# EAGLE design MMMM Bottom (EAGLE 9.1.0)
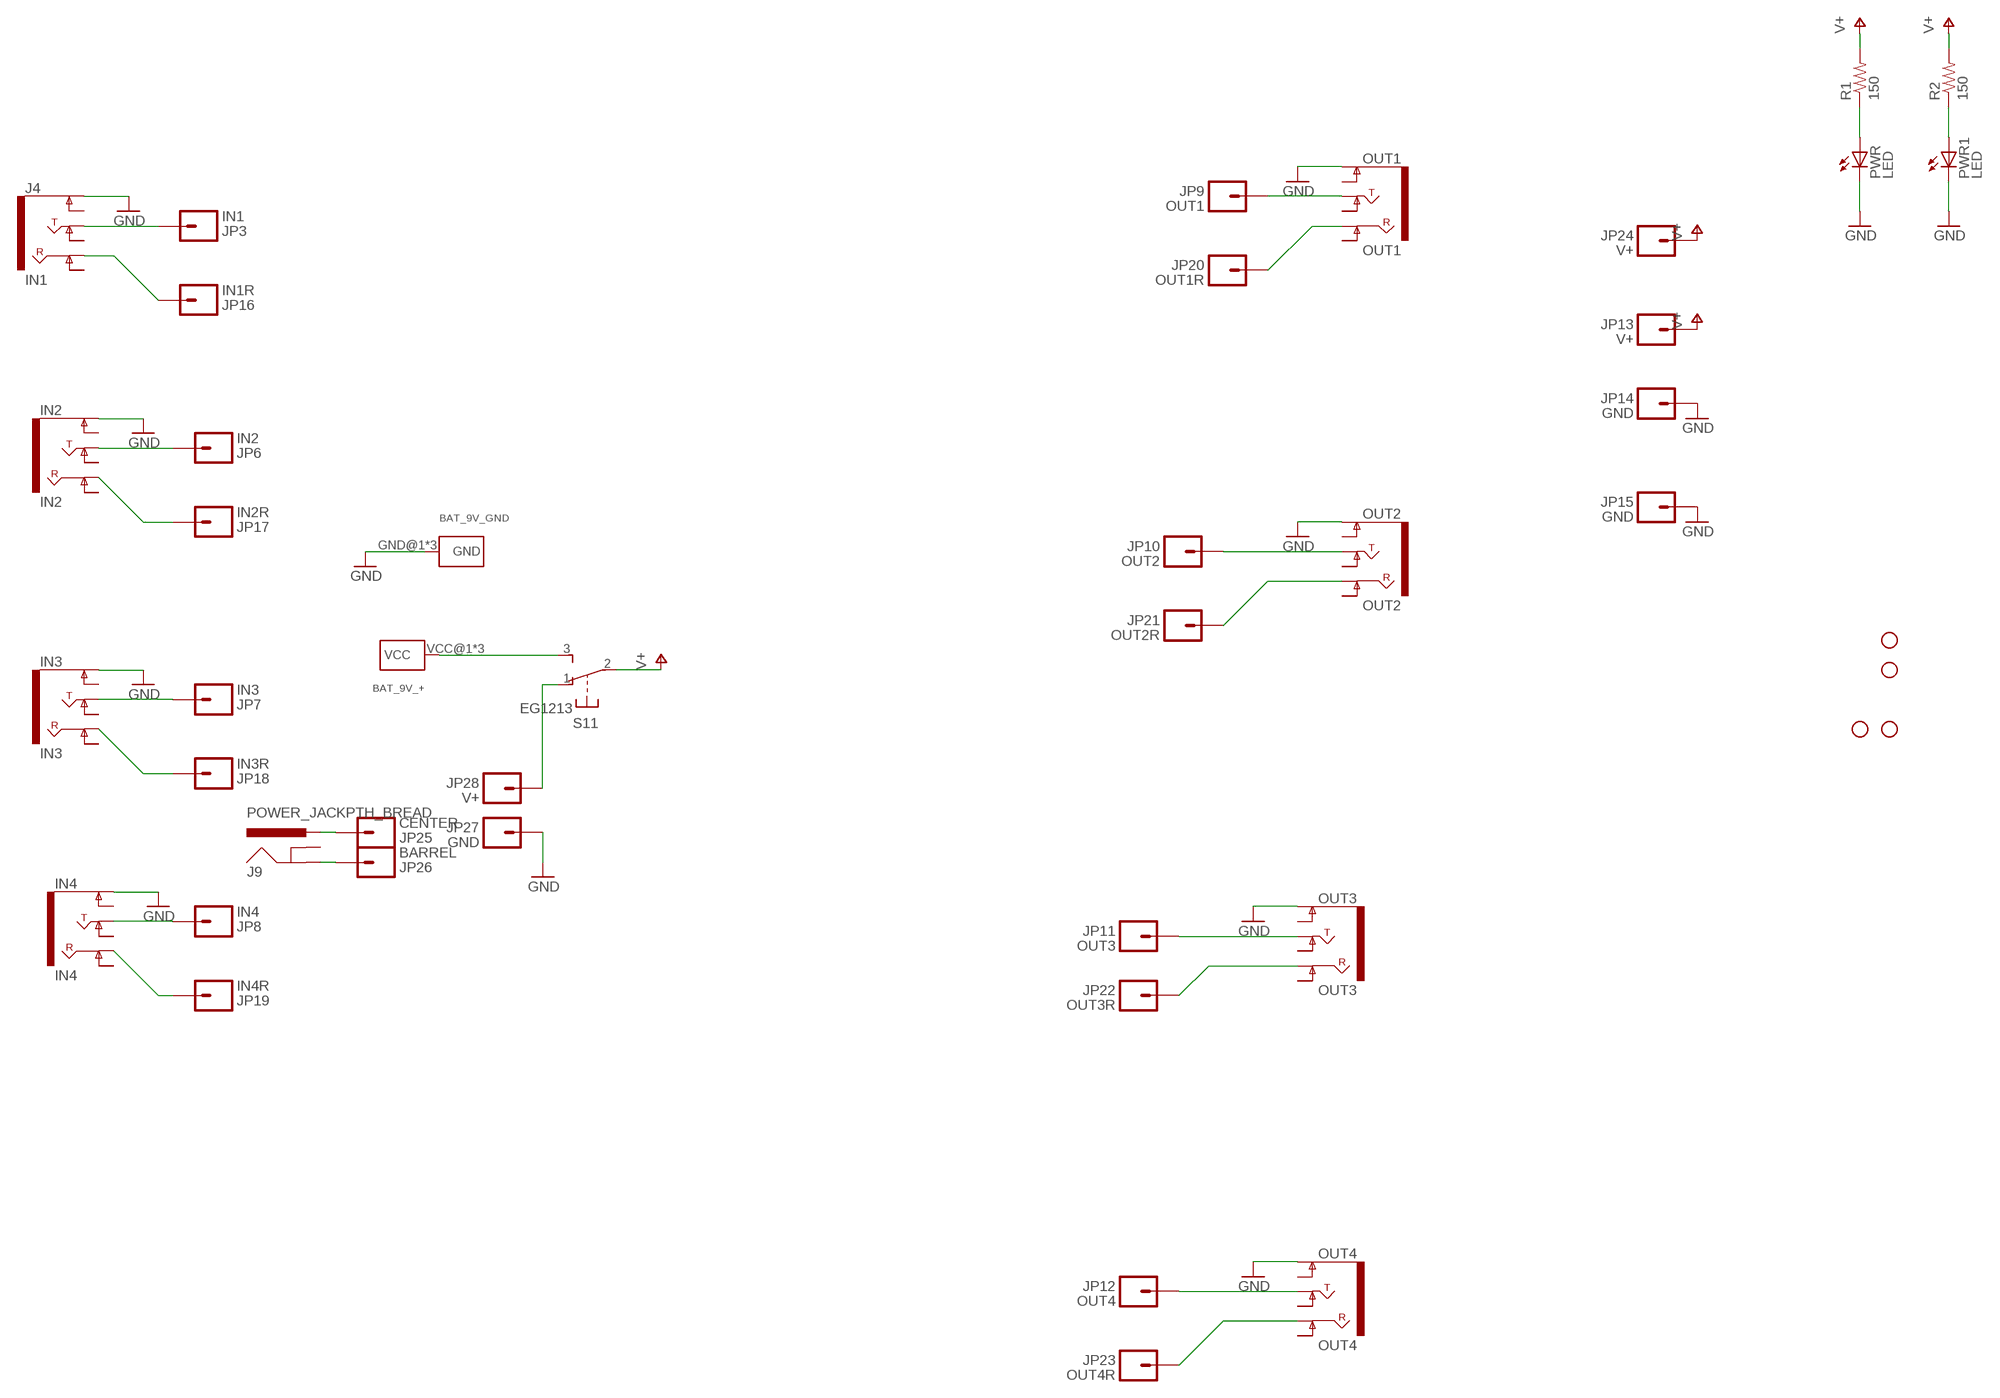
[diagram p0: schematic, sheet 1]

## Parts
BAT_9V_+  KEYSTONE-637  [KEYSTONE_AA_AAA_BATTERY_TERMINAL-637]
BAT_9V_GND  KEYSTONE-629  [KEYSTONE_AA_AAA_BATTERY_TERMINAL-629]
IN2  IN2  AUDIO-JACK4-.25-HORIZ-TRS  [AUDIO-JACK-.25-INCH-HORIZ-PTH]
IN3  IN3  AUDIO-JACK4-.25-HORIZ-TRS  [AUDIO-JACK-.25-INCH-HORIZ-PTH]
IN4  IN4  AUDIO-JACK4-.25-HORIZ-TRS  [AUDIO-JACK-.25-INCH-HORIZ-PTH]
J4  IN1  AUDIO-JACK4-.25-HORIZ-TRS  [AUDIO-JACK-.25-INCH-HORIZ-PTH]
J9  POWER_JACKPTH_BREAD  [POWER_JACK_PTH_BREAD]
JP1  STAND-OFF  [STAND-OFF]
JP2  STAND-OFF  [STAND-OFF]
JP3  IN1  HEADER-1X1  [1X01_SIDE_NAME]
JP4  STAND-OFF  [STAND-OFF]
JP5  STAND-OFF  [STAND-OFF]
JP6  IN2  HEADER-1X1  [1X01_SIDE_NAME]
JP7  IN3  HEADER-1X1  [1X01_SIDE_NAME]
JP8  IN4  HEADER-1X1  [1X01_SIDE_NAME]
JP9  OUT1  HEADER-1X1  [1X01_SIDE_NAME]
JP10  OUT2  HEADER-1X1  [1X01_SIDE_NAME]
JP11  OUT3  HEADER-1X1  [1X01_SIDE_NAME]
JP12  OUT4  HEADER-1X1  [1X01_SIDE_NAME]
JP13  V+  HEADER-1X1  [1X01_SIDE_NAME]
JP14  GND  HEADER-1X1  [1X01_SIDE_NAME]
JP15  GND  HEADER-1X1  [1X01_SIDE_NAME]
JP16  IN1R  HEADER-1X1  [1X01_SIDE_NAME]
JP17  IN2R  HEADER-1X1  [1X01_SIDE_NAME]
JP18  IN3R  HEADER-1X1  [1X01_SIDE_NAME]
JP19  IN4R  HEADER-1X1  [1X01_SIDE_NAME]
JP20  OUT1R  HEADER-1X1  [1X01_SIDE_NAME]
JP21  OUT2R  HEADER-1X1  [1X01_SIDE_NAME]
JP22  OUT3R  HEADER-1X1  [1X01_SIDE_NAME]
JP23  OUT4R  HEADER-1X1  [1X01_SIDE_NAME]
JP24  V+  HEADER-1X1  [1X01_SIDE_NAME]
JP25  CENTER  HEADER-1X11X01_SIDE_NAME_SML  [1X01_SIDE_NAME_SML]
JP26  BARREL  HEADER-1X11X01_SIDE_NAME_SML  [1X01_SIDE_NAME_SML]
JP27  GND  HEADER-1X11X01_SIDE_NAME_SML  [1X01_SIDE_NAME_SML]
JP28  V+  HEADER-1X11X01_SIDE_NAME_SML  [1X01_SIDE_NAME_SML]
OUT1  OUT1  AUDIO-JACK4-.25-HORIZ-TRS  [AUDIO-JACK-.25-INCH-HORIZ-PTH]
OUT2  OUT2  AUDIO-JACK4-.25-HORIZ-TRS  [AUDIO-JACK-.25-INCH-HORIZ-PTH]
OUT3  OUT3  AUDIO-JACK4-.25-HORIZ-TRS  [AUDIO-JACK-.25-INCH-HORIZ-PTH]
OUT4  OUT4  AUDIO-JACK4-.25-HORIZ-TRS  [AUDIO-JACK-.25-INCH-HORIZ-PTH]
PWR  LED  LED-3MM-MINUS  [LED3MM-MINUS]
PWR1  LED  LED-3MM-MINUS  [LED3MM-MINUS]
R1  150  R-US_0204/5  [0204/5]
R2  150  R-US_0204/5  [0204/5]
S1  EG1213  [EG1213]

## Nets
GND: BAT_9V_GND.GND@1(GND) BAT_9V_GND.GND@2(GND) BAT_9V_GND.GND@3(GND) IN2.SLEEVE(EARTH) IN3.SLEEVE(EARTH) IN4.SLEEVE(EARTH) J4.SLEEVE(EARTH) JP14.1 JP15.1 JP27.1 OUT1.SLEEVE(EARTH) OUT2.SLEEVE(EARTH) OUT3.SLEEVE(EARTH) OUT4.SLEEVE(EARTH) PWR1.K(C) PWR.K(C)
N$1: PWR.A R1.1
N$2: IN2.TIP JP6.1
N$3: JP9.1 OUT1.TIP
N$4: IN3.TIP JP7.1
N$5: J4.TIP JP3.1
N$6: IN4.TIP JP8.1
N$7: J4.RING JP16.1
N$8: IN3.RING JP18.1
N$9: IN4.RING JP19.1
N$10: IN2.RING JP17.1
N$11: JP20.1 OUT1.RING
N$12: JP23.1 OUT4.RING
N$13: JP22.1 OUT3.RING
N$14: JP21.1 OUT2.RING
N$15: JP28.1 S1.1(1:O)
N$16: BAT_9V_+.VCC@1(VCC) BAT_9V_+.VCC@2(VCC) BAT_9V_+.VCC@3(VCC) S1.3(1:S)
N$17: PWR1.A R2.1
N$18: J9.PWR JP25.1
N$19: J9.GND JP26.1
N$27: JP10.1 OUT2.TIP
N$35: JP11.1 OUT3.TIP
N$43: JP12.1 OUT4.TIP
V+: JP13.1 JP24.1 R1.2 R2.2 S1.2(1:P)
Unconnected: IN2.RING-NORM IN2.SLEEVE-NORM(EARTH-NORM) IN2.TIP-NORM IN3.RING-NORM IN3.SLEEVE-NORM(EARTH-NORM) IN3.TIP-NORM IN4.RING-NORM IN4.SLEEVE-NORM(EARTH-NORM) IN4.TIP-NORM J4.RING-NORM J4.SLEEVE-NORM(EARTH-NORM) J4.TIP-NORM J9.GNDBREAK OUT1.RING-NORM OUT1.SLEEVE-NORM(EARTH-NORM) OUT1.TIP-NORM OUT2.RING-NORM OUT2.SLEEVE-NORM(EARTH-NORM) OUT2.TIP-NORM OUT3.RING-NORM OUT3.SLEEVE-NORM(EARTH-NORM) OUT3.TIP-NORM OUT4.RING-NORM OUT4.SLEEVE-NORM(EARTH-NORM) OUT4.TIP-NORM S1.MT1(MT) S1.MT2(MT)

## Library data of the parts
BAT_9V_+ = kanflo:KEYSTONE-637: Keystone 637 PCB Mount Battery Contact for 1 (AA), 1 (AAA), 1 (N), Button Contact Links Data sheet <http://docs-europe.electrocomponents.com/webdocs/13ee/0900766b813ee63e.pdf> RS Online <http://se.rs-online.com/web/p/battery-holders-mounts/3670602/>
BAT_9V_GND = kanflo:KEYSTONE-629: Keystone 629 PCB Mount Battery Contact for 1 (AA), 1 (AAA), 1 (N), Coil Spring Contact Links Data sheet <http://docs-europe.electrocomponents.com/webdocs/002e/0900766b8002ef6f.pdf> RS Online <http://se.rs-online.com/web/p/battery-holders-mounts/2050057/>
IN2-IN4 J4 OUT1-OUT4 = SparkFun-Connectors:AUDIO-JACK4-.25-HORIZ-TRS: 1/4" TRS jack, horizontal Production SKU: COM-11144 Footprint unproven - datasheet and part seem to be slightly different; PROD_ID: CONN-12339; SF_ID: COM-11144
J9 = SparkFun-Connectors:POWER_JACK: Power Jack This is the standard 5.5mm barrel jack for power. The PTH is the most common, proven, reliable, footprint. The Slot footprint only works if the mill layer is transmitted to the PCB fab house so be warned. Mating wall wart : TOL-00298 (and others); PROD_ID: PRT-10811
JP1 JP2 JP4 JP5 = SparkFun:STAND-OFF: Stand Off This is the mechanical footprint for a #4 phillips button head screw. Use the keepout ring to avoid running the screw head into surrounding components. SKU : PRT-00447
JP3 JP6-JP28 = TOF:HEADER-1X1: Header 1 Standard 1-pin 0.1" header. Use with straight break away headers (SKU : PRT-00116), right angle break away headers (PRT-00553), swiss pins (PRT-00743), machine pins (PRT-00117), and female headers (PRT-00115).
PWR PWR1 = akafugu:LED: LEDs Standard schematic elements and footprints for 5mm, 3mm, 1206, and 0603 sized LEDs. 5mm - Spark Fun Electronics SKU : COM-00529 (and others)
R1 R2 = adafruit:R-US_: RESISTOR, American symbol
S1 = adafruit:EG1213: E-Switch right-angle slide SPDT Part #EG1213 http://www.ladyada.net/library/eagle

## Board
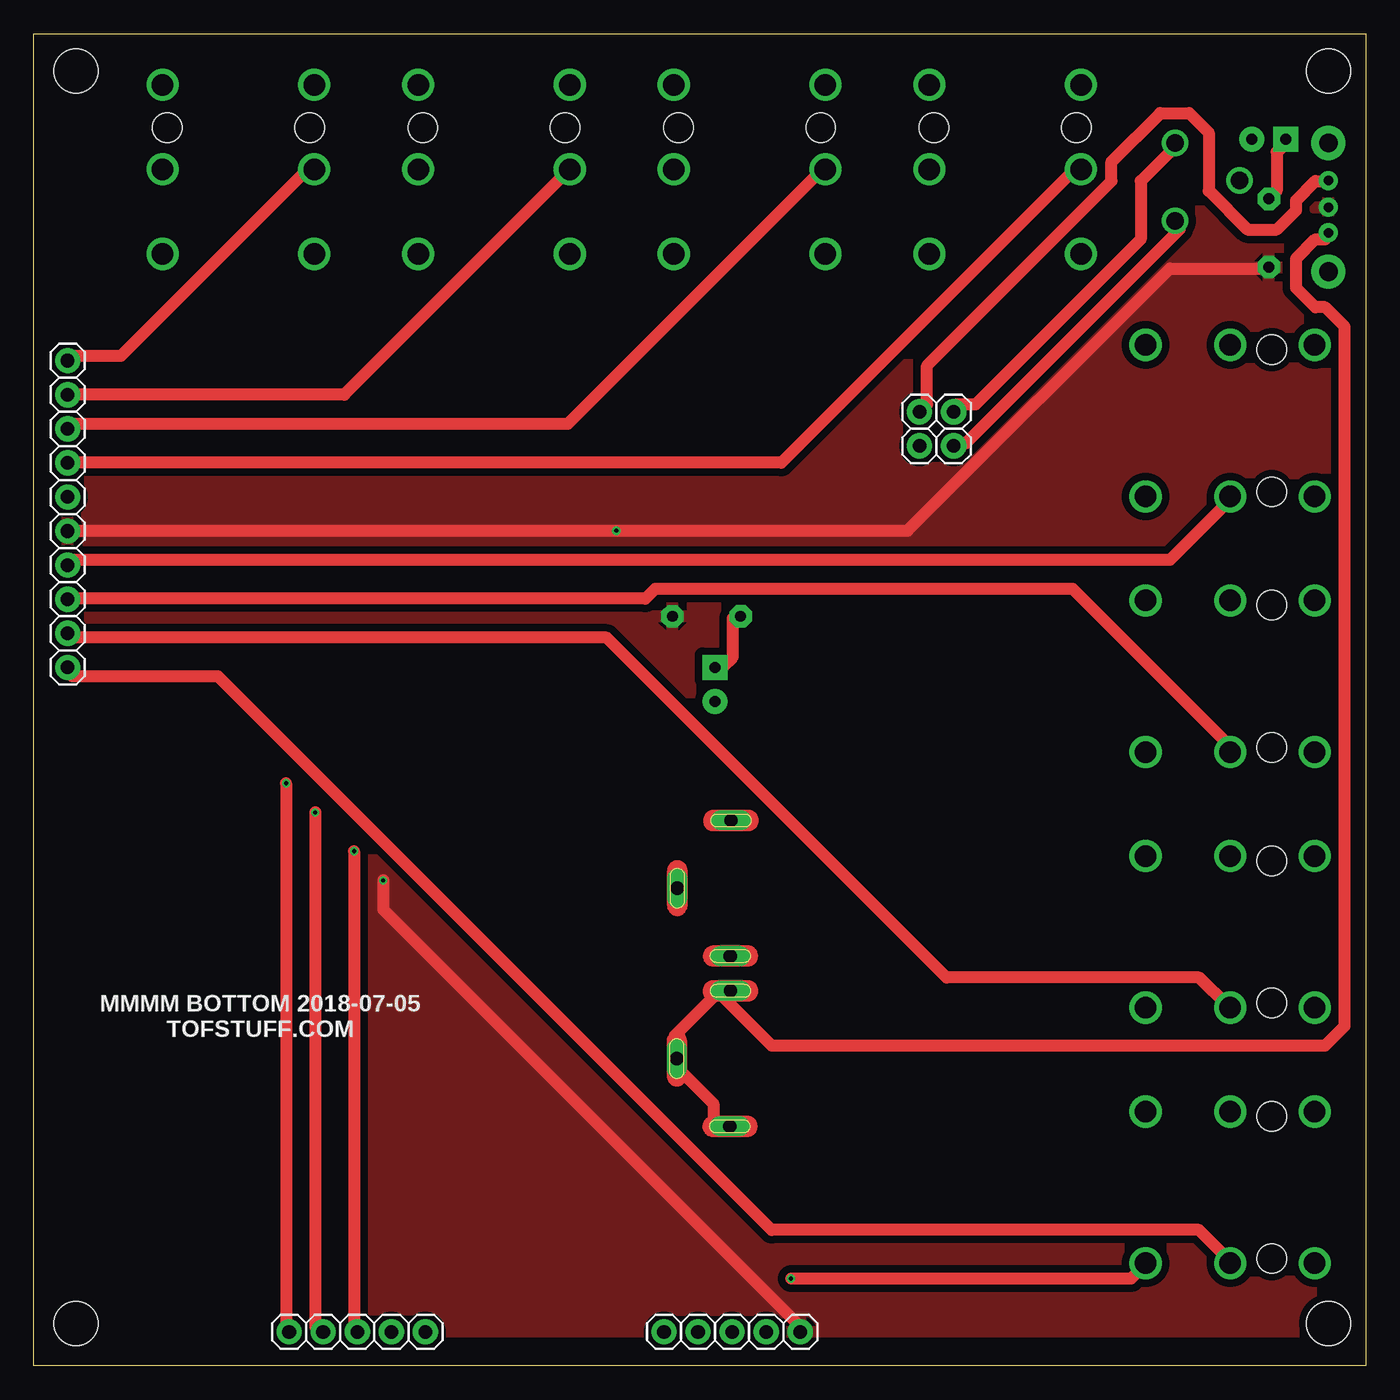
[diagram p1: board, top side]
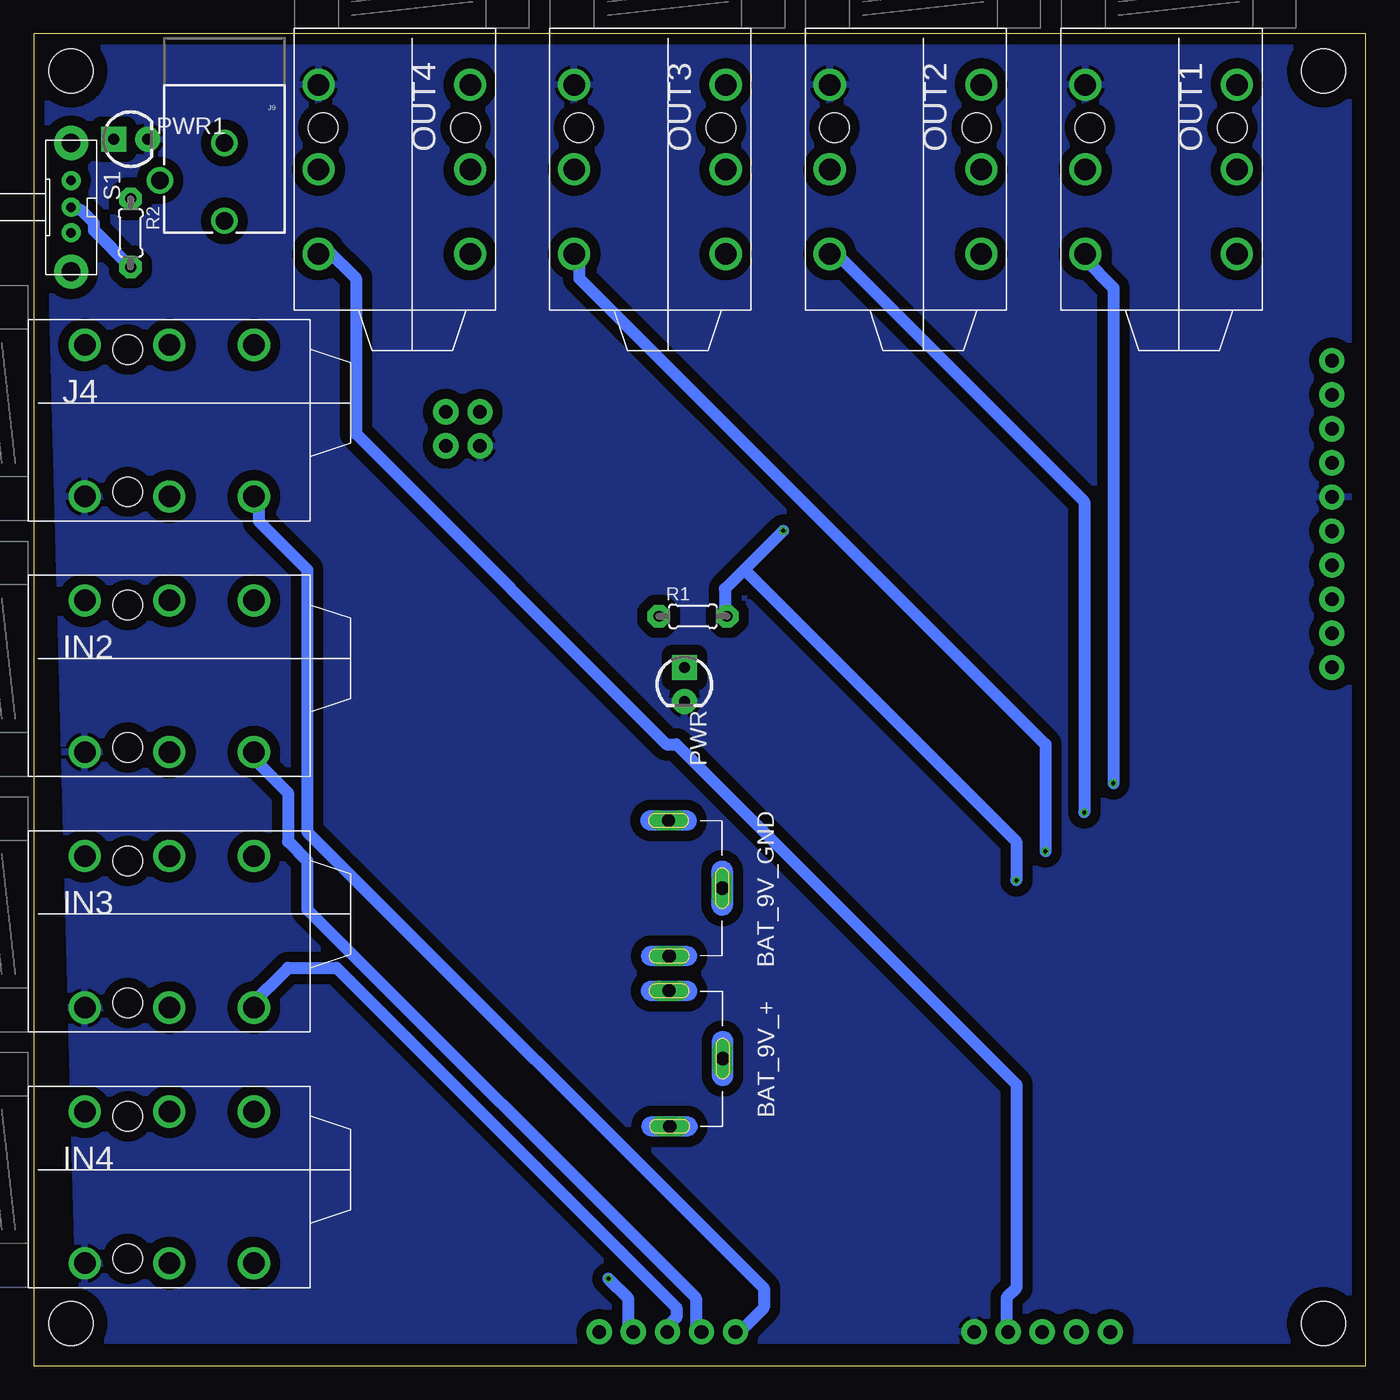
[diagram p2: board, bottom side, seen from below]

Size 99.31 x 99.31 mm. Coordinates in mm from the lower left corner, seen from the top.
Outline: 0,0 0,99.31 99.31,99.31 99.31,0 0,0
Copper layers (1*16): Top 0.035mm / dielectric 1.5mm / Bottom 0.035mm
Design rules "EagleRules *": minimum track width 35mil, minimum drill 12mil, track to track 22mil, track to pad 22mil, pad to pad 7mil, via to via 7mil, smd to smd 0mil, copper to edge 20mil, drill to drill 10mil, minimum pad ring 10mil, minimum via ring 6mil, stop-mask expansion 2mil, vias tented up to drill 25mil, thermal gap 10mil

### Footprints (pad centres in the part's own frame; a part is rotated, then mirrored left to right if it is on the bottom)
KEYSTONE_AA_AAA_BATTERY_TERMINAL-637 = drill 1 pad 1.5 long: VCC@1 5,-1.1; VCC@2 -0.05,2.85; VCC@3 -5.1,-1.15
KEYSTONE_AA_AAA_BATTERY_TERMINAL-629 = drill 1 pad 1.5 long: GND@1 5,-0.5; GND@2 -0.05,3.45; GND@3 -5.1,-0.55
AUDIO-JACK-.25-INCH-HORIZ-PTH = drill 1.6: RING 10.5,-6.95; RING-NORM 10.5,4.35; SLEEVE 4.2,-6.95; SLEEVE-NORM 4.2,4.35; TIP 16.8,-6.95; TIP-NORM 16.8,4.35 | hole 2.2: 7.4,4; 7.4,-6.6
POWER_JACK_PTH_BREAD = drill 1.3: GND 0,7.9; GNDBREAK 4.8,10.7; PWR 0,13.7
STAND-OFF = hole 3.302: 0,0
1X01_SIDE_NAME = drill 1.016 pad 1.88: 1 0,0
1X01_SIDE_NAME_SML = drill 1.016 pad 1.88: 1 0,0
LED3MM-MINUS = drill 0.813 pad 1.88 square: A -1.27,0 | drill 0.813 pad 1.88: K 1.27,0
0204/5 = drill 0.813 pad 1.676 octagon: 1 -2.54,0; 2 2.54,0
EG1213 = drill 0.7 pad 1.422: 1 -2,0; 2 0,0; 3 1.9,0 | drill 1.4 pad 2.54: MT1 -4.8,0; MT2 4.8,0

### Placement (x,y rotation side)
BAT_9V_+  50.8,22.86 270 bottom
BAT_9V_GND  51.44,35.56 270 bottom
IN2  99.69,52.7 0 bottom
IN3  99.69,33.66 0 bottom
IN4  99.69,14.61 0 bottom
J4  99.69,71.75 0 bottom
J9  85.09,99.06 180 bottom
JP1  3.17,3.17 0 top
JP2  3.17,96.52 0 top
JP3  46.99,2.54 90 top
JP4  96.52,3.17 0 top
JP5  96.52,96.52 0 top
JP6  49.53,2.54 90 top
JP7  52.07,2.54 90 top
JP8  54.61,2.54 90 top
JP9  19.05,2.54 90 top
JP10  21.59,2.54 90 top
JP11  24.13,2.54 90 top
JP12  26.67,2.54 90 top
JP13  57.15,2.54 90 top
JP14  29.21,2.54 90 top
JP15  2.54,64.77 0 top
JP16  2.54,59.69 0 top
JP17  2.54,57.15 0 top
JP18  2.54,54.61 0 top
JP19  2.54,52.07 0 top
JP20  2.54,74.93 0 top
JP21  2.54,72.39 0 top
JP22  2.54,69.85 0 top
JP23  2.54,67.31 0 top
JP24  2.54,62.23 0 top
JP25  68.58,68.58 0 top
JP26  68.58,71.12 0 top
JP27  66.04,68.58 180 top
JP28  66.04,71.12 180 top
OUT1  13.97,99.69 270 bottom
OUT2  33.02,99.69 270 bottom
OUT3  52.07,99.69 270 bottom
OUT4  71.12,99.69 270 bottom
PWR  50.8,50.8 270 bottom
PWR1  92.08,91.44 0 bottom
R1  50.16,55.88 0 bottom
R2  92.08,84.45 270 bottom
S1  96.52,86.36 270 bottom

### Tracks (layer width: path | path; a pad name or v marks a point on that pad's centre or on a via)
GND
  pour Bottom (isolate 0.762): 1.27,98.42 98.42,98.42 95.89,1.91 1.27,1.91
N$1
  Top 0.889: R1.1 52.12,55.74 52.12,52.84 51.4,52.12 PWR.A
N$2
  Bottom 0.889: JP6.1 49.95,2.9 49.95,5.07 78.91,34.02 78.91,37.64 80.35,39.09 80.35,42.71 83.25,45.61 IN2.TIP
N$3  (via drill 0.3)
  Top 0.889: v18.82,43.43 18.82,2.9 JP9.1
  Bottom 0.889: v18.82,43.43 18.82,80.35 20.99,82.53 OUT1.TIP
N$4
  Bottom 0.889: JP7.1 52.12,2.9 51.4,3.62 51.4,4.34 76.73,29.68 80.35,29.68 83.25,26.78 IN3.TIP
N$5
  Bottom 0.889: JP3.1 46.33,2.9 44.88,4.34 44.88,5.79 78.91,39.81 78.91,59.36 82.53,62.98 82.53,64.43 J4.TIP
N$6  (via drill 0.3)
  Top 0.889: v56.46,6.51 81.8,6.51 82.53,7.24 IN4.TIP
  Bottom 0.889: v56.46,6.51 55.02,5.07 55.02,2.9 JP8.1
N$7
  Top 0.889: JP16.1 2.9,60.08 84.7,60.08 89.04,64.43 J4.RING
N$8
  Top 0.889: JP18.1 2.9,54.29 42.71,54.29 68.05,28.96 86.87,28.96 89.04,26.78 IN3.RING
N$9
  Top 0.889: JP19.1 2.9,51.4 13.75,51.4 55.02,10.13 86.87,10.13 89.04,7.96 IN4.RING
N$10
  Top 0.889: JP17.1 2.9,57.19 45.61,57.19 46.33,57.91 77.46,57.91 89.04,46.33 IN2.RING
N$11
  Top 0.889: JP20.1 2.9,75.29 6.51,75.29 20.27,89.04 OUT1.RING
N$12
  Top 0.889: JP23.1 2.9,67.32 55.74,67.32 77.46,89.04 OUT4.RING
N$13
  Top 0.889: JP22.1 2.9,70.22 39.81,70.22 58.64,89.04 OUT3.RING
N$14
  Top 0.889: JP21.1 2.9,72.39 23.16,72.39 39.81,89.04 OUT2.RING
N$15
  Top 0.889: S1.1 96.28,88.32 95.56,88.32 94.11,86.87 94.11,86.14 92.66,84.7 90.49,84.7 87.59,87.59 87.59,91.94 86.14,93.38 83.97,93.38 80.35,89.76 80.35,88.32 66.6,74.56 66.6,71.67 JP28.1
N$16
  Top 0.889: BAT_9V_+.VCC@1 50.67,18.1 50.67,19.55 47.78,22.44 BAT_9V_+.VCC@2 47.78,23.16 47.78,24.61 50.67,27.51 BAT_9V_+.VCC@3 51.4,27.51 55.02,23.89 96.28,23.89 97.73,25.34 97.73,77.46 96.28,78.91 95.56,78.91 94.11,80.35 94.11,82.53 95.56,83.97 96.28,83.97 S1.3
N$17
  Top 0.889: R2.1 92.66,87.59 92.66,90.49 93.38,91.21 PWR1.A
N$18
  Top 0.889: JP25.1 68.77,68.77 69.49,68.77 85.42,84.7 J9.PWR
N$19
  Top 0.889: JP26.1 68.77,71.67 70.22,71.67 82.53,83.97 82.53,88.32 84.7,90.49 J9.GND
N$27  (via drill 0.3)
  Top 0.889: v20.99,41.26 20.99,2.9 JP10.1
  Bottom 0.889: v20.99,41.26 20.99,64.43 39.81,83.25 OUT2.TIP
N$35  (via drill 0.3)
  Top 0.889: v23.89,38.37 23.89,2.9 JP11.1
  Bottom 0.889: v23.89,38.37 23.89,46.33 58.64,81.08 58.64,82.53 OUT3.TIP
N$43
  Bottom 0.889: JP12.1 26.78,2.9 26.78,5.07 26.06,5.79 26.06,20.99 51.4,46.33 52.12,46.33 75.29,69.49 75.29,81.08 77.46,83.25 OUT4.TIP
V+  (via drill 0.3)
  Top 0.889: JP24.1 2.9,62.26 v43.43,62.26 65.15,62.26 84.7,81.8 91.94,81.8 R2.2 | v26.06,36.2 26.06,34.02 57.19,2.9 JP13.1
  Bottom 0.889: v43.43,62.26 46.33,59.36 | 46.33,59.36 47.78,57.91 47.78,56.46 R1.2 | v26.06,36.2 26.06,39.09 46.33,59.36 | R2.2 94.81,84.64 94.81,85.17 95.81,86.17 96.33,86.17 S1.2
  pour Top: 2.54,96.52 96.52,96.52 96.52,2.54 2.54,2.54

### Text on the board
tPlace: MMMM BOTTOM 2018-07-05 / TOFSTUFF.COM